# Altium schematic sheet SoM-Unused.SchDoc
size A3; DocumentNumber: 2; SheetNumber: 2; SheetTotal: 10; PageSetup: Record=PageOptions|CenterHorizontal=True|CenterVertical=True|PrintScale=0.97|XCorrection=1.00|YCorrection=1.00|PrintKind=1|BorderSize=5000000|LeftOffset=0|BottomOffset=0|Orientation=2|PaperLength=2970|PaperWidth=2100|Scale=100|PaperSource=7|PrintQuality=600|MediaType=1|DitherType=10|PaperKind=A4|PrintScaleMode=1
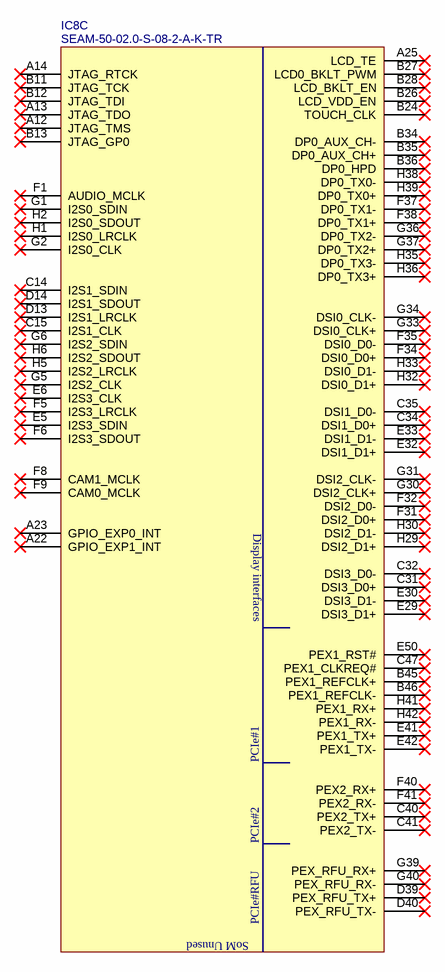
[diagram p0: SoM-Unused.SchDoc]

## Parts
IC8  SEAM-50-02.0-S-08-2-A-K-TR  [Nvidia-TX1-SoM]  (part C of 4)

## Nets

Not connected (* = marked no-connect by the designer): IC8 A12(JTAG_TMS)* A13(JTAG_TDO)* A14(JTAG_RTCK)* A22(GPIO_EXP1_INT)* A23(GPIO_EXP0_INT)* A25(LCD_TE)* B11(JTAG_TCK)* B12(JTAG_TDI)* B13(JTAG_GP0)* B24(TOUCH_CLK)* B26(LCD_VDD_EN)* B27(LCD0_BKLT_PWM)* B28(LCD_BKLT_EN)* B34(DP0_AUX_CH-)* B35(DP0_AUX_CH+)* B36(DP0_HPD)* B45(PEX1_REFCLK+)* B46(PEX1_REFCLK-)* C14(I2S1_SDIN)* C15(I2S1_CLK)* C31(DSI3_D0+)* C32(DSI3_D0-)* C34(DSI1_D0+)* C35(DSI1_D0-)* C40(PEX2_TX+)* C41(PEX2_TX-)* C47(PEX1_CLKREQ#)* D13(I2S1_LRCLK)* D14(I2S1_SDOUT)* D39(PEX_RFU_TX+)* D40(PEX_RFU_TX-)* E5(I2S3_SDIN)* E6(I2S3_CLK)* E29(DSI3_D1+)* E30(DSI3_D1-)* E32(DSI1_D1+)* E33(DSI1_D1-)* E41(PEX1_TX+)* E42(PEX1_TX-)* E50(PEX1_RST#)* F1(AUDIO_MCLK)* F5(I2S3_LRCLK)* F6(I2S3_SDOUT)* F8(CAM1_MCLK)* F9(CAM0_MCLK)* F31(DSI2_D0+)* F32(DSI2_D0-)* F34(DSI0_D0+)* F35(DSI0_D0-)* F37(DP0_TX1-)* F38(DP0_TX1+)* F40(PEX2_RX+)* F41(PEX2_RX-)* G1(I2S0_SDIN)* G2(I2S0_CLK)* G5(I2S2_CLK)* G6(I2S2_SDIN)* G30(DSI2_CLK+)* G31(DSI2_CLK-)* G33(DSI0_CLK+)* G34(DSI0_CLK-)* G36(DP0_TX2-)* G37(DP0_TX2+)* G39(PEX_RFU_RX+)* G40(PEX_RFU_RX-)* H1(I2S0_LRCLK)* H2(I2S0_SDOUT)* H5(I2S2_LRCLK)* H6(I2S2_SDOUT)* H29(DSI2_D1+)* H30(DSI2_D1-)* H32(DSI0_D1+)* H33(DSI0_D1-)* H35(DP0_TX3-)* H36(DP0_TX3+)* H38(DP0_TX0-)* H39(DP0_TX0+)* H41(PEX1_RX+)* H42(PEX1_RX-)*

## Notes on the sheet
- Title:
- Size:
- Date:
- A3
- Revision:
- Page:
- of
- Antmicro Ltd.
- File:
- www.antmicro.com
- (in symbol Nvidia-TX1-SoM, part C) Display interfaces; PCIe#1; PCIe#2; PCIe#RFU; SoM Unused

## Library data of the parts
IC8 = Nvidia-TX1-SoM: TX1 module (board connector); Manufacturer: Samtec; Part Number: Nvidia-TX1-SoM; Part Symbol: SEAM-50-02.0-S-08-2-A-K-TR; Value: SEAM-50-02.0-S-08-2-A-K-TR